# EAGLE schematic sensordrone audio jack (EAGLE 6.2)
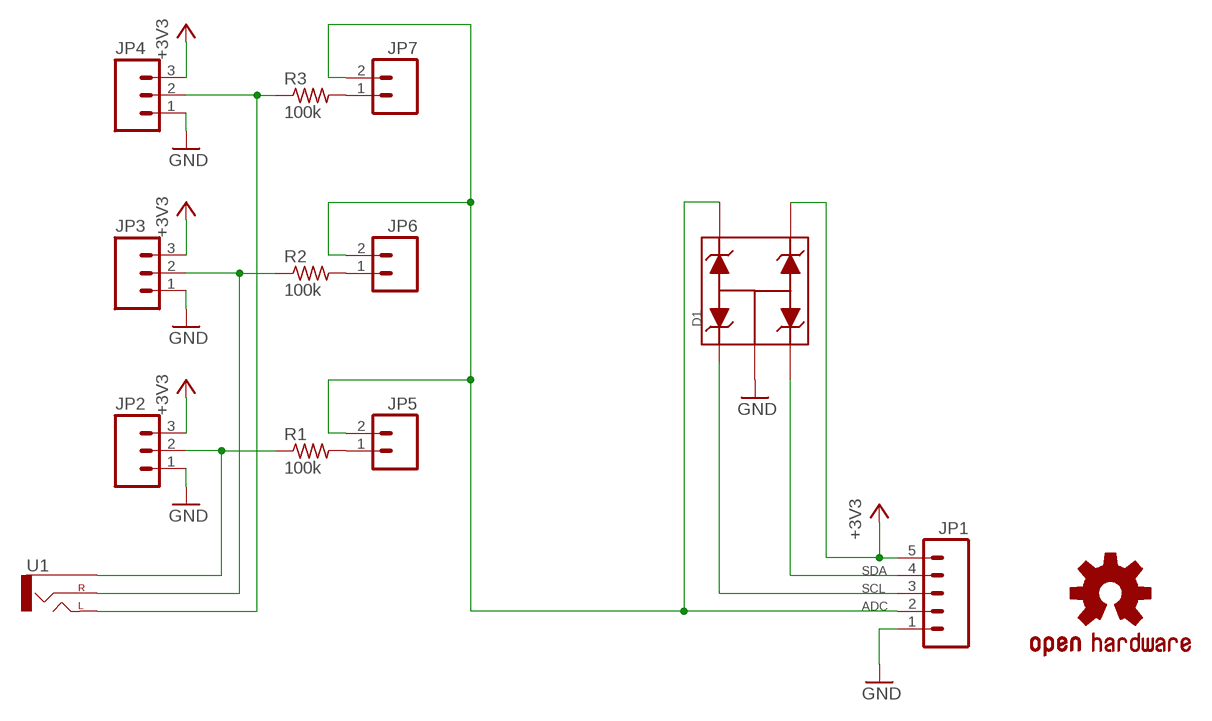
[diagram p0: schematic, sheet 1]

## Parts
D1  CPDV5  [SOT353]
JP1  M05PTH_LONGPADS  [1X05_LONGPADS]
JP2  M03PTH  [1X03]
JP3  M03PTH  [1X03]
JP4  M03PTH  [1X03]
JP5  M02PTH  [1X02]
JP6  M02PTH  [1X02]
JP7  M02PTH  [1X02]
R1  100k  R-US_R0402  [R0402]
R2  100k  R-US_R0402  [R0402]
R3  100k  R-US_R0402  [R0402]
U1  AUDIO-JACKPTH  [AUDIO-JACK]
U$1  OSHW-LOGOS  [OSHW-LOGO-S]

## Nets
+3V3: D1.4 JP1.5 JP2.3 JP3.3 JP4.3
ADC: D1.5 JP1.2 JP5.2 JP6.2 JP7.2
GND: D1.2 JP1.1 JP2.1 JP3.1 JP4.1
N$1: JP2.2 R1.1 U1.SLEEVE
N$2: JP3.2 R2.1 U1.RING(RIGHT)
N$3: JP4.2 R3.1 U1.TIP(LEFT)
N$4: JP5.1 R1.2
N$5: JP6.1 R2.2
N$6: JP7.1 R3.2
SCL: D1.1 JP1.3
SDA: D1.3 JP1.4

## Library data of the parts
D1 = DMM:CPDV5: SMD ESD Protection Diode
JP1 = SparkFun-Connectors:M05: Header 5 Standard 5-pin 0.1" header. Use with straight break away headers (SKU : PRT-00116), right angle break away headers (PRT-00553), swiss pins (PRT-00743), machine pins (PRT-00117), and female headers (PRT-00115). Molex polarized connector foot print use with SKU : PRT-08230 with associated crimp pins and housings.
JP2-JP4 = SparkFun-Connectors:M03: Header 3 Standard 3-pin 0.1" header. Use with straight break away headers (SKU : PRT-00116), right angle break away headers (PRT-00553), swiss pins (PRT-00743), machine pins (PRT-00117), and female headers (PRT-00115). Molex polarized connector foot print use with SKU : PRT-08232 with associated crimp pins and housings.
JP5-JP7 = SparkFun-Connectors:M02: Header 2 Standard 2-pin 0.1" header. Use with straight break away headers (SKU : PRT-00116), right angle break away headers (PRT-00553), swiss pins (PRT-00743), machine pins (PRT-00117), and female headers (PRT-00115). Molex polarized connector foot print use with SKU : PRT-08233 with associated crimp pins and housings.
R1-R3 = rcl:R-US_: RESISTOR, American symbol
U1 = SparkFun-Connectors:AUDIO-JACK: 3.5mm Audio Jack Simple 3.5mm common PCB mount audio jack. SKU: PRT-08032
U$1 = SparkFun-Aesthetics:OSHW-LOGO: Open Source Hardware Logo This logo indicates the piece of hardware it is found on incorporates a OSHW license and/or adheres to the definition of open source hardware found here: http://freedomdefined.org/OSHW